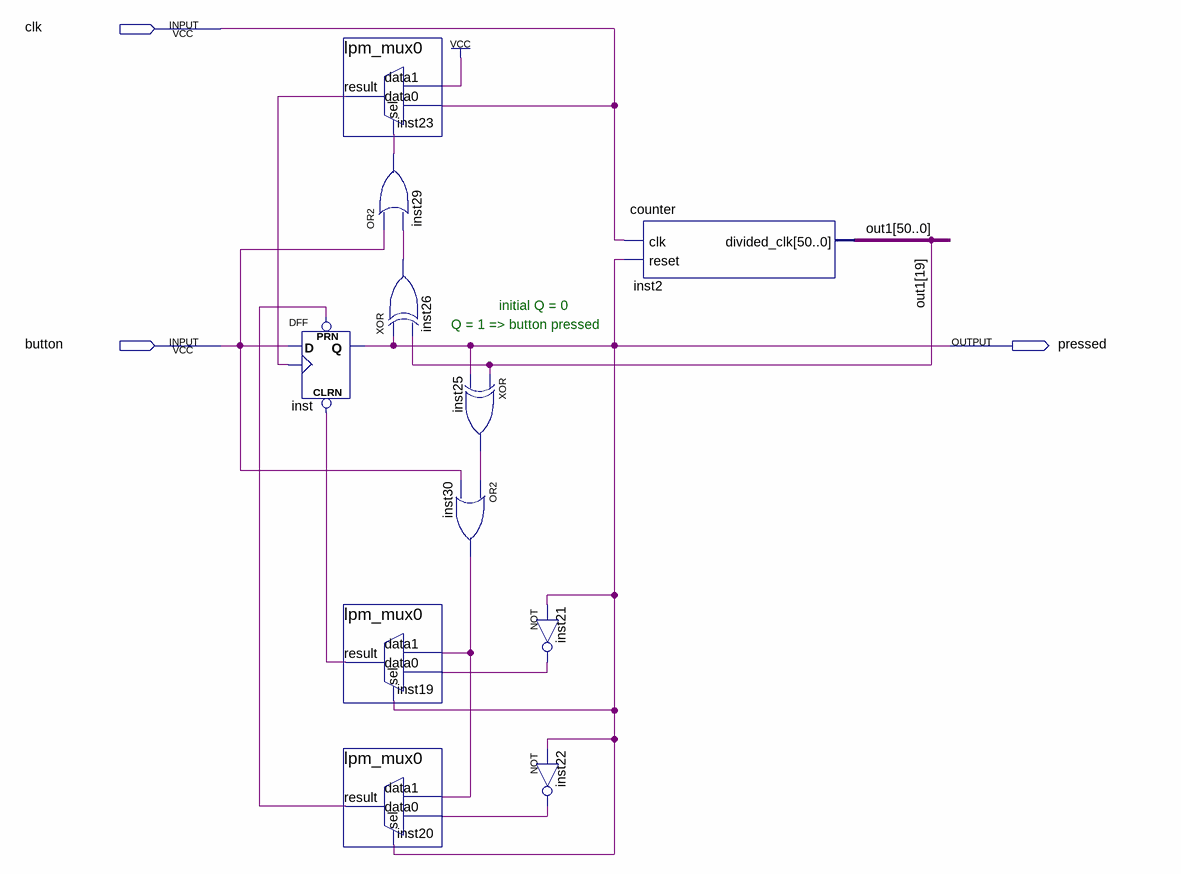
[diagram p0: schematic sheet]
// Quartus schematic buttonPressIndicator.bdf as structural Verilog: 11 symbols, 3 pins
module buttonPressIndicator (
  input  clk,
  input  button,
  output pressed
);

  wire inst19_result, inst20_result, inst21_out, inst22_out, inst23_result, inst25_out, inst26_out,
       inst29_out, inst30_out;
  wire [50:0] out1;

  DFF inst (.CLRN(inst19_result), .CLK(inst23_result), .D(button), .PRN(inst20_result), .Q(pressed));
  lpm_mux0 inst23 (.data1(1'b1), .data0(clk), .sel(inst29_out), .result(inst23_result));
  or inst29 (inst29_out, button, inst26_out);
  xor inst26 (inst26_out, pressed, out1[19]);
  lpm_mux0 inst19 (.data1(inst30_out), .data0(inst21_out), .sel(pressed), .result(inst19_result));
  lpm_mux0 inst20 (.data1(inst30_out), .data0(inst22_out), .sel(pressed), .result(inst20_result));
  xor inst25 (inst25_out, out1[19], pressed);
  or inst30 (inst30_out, inst25_out, button);
  not inst21 (inst21_out, pressed);
  not inst22 (inst22_out, pressed);
  counter inst2 (.clk(clk), .reset(pressed), .divided_clk(out1));

  // Notes on the sheet:
  //   initial Q = 0
  //   Q = 1 => button pressed
endmodule
